# Altium schematic sheet SUPPLY.SchDoc
size A2
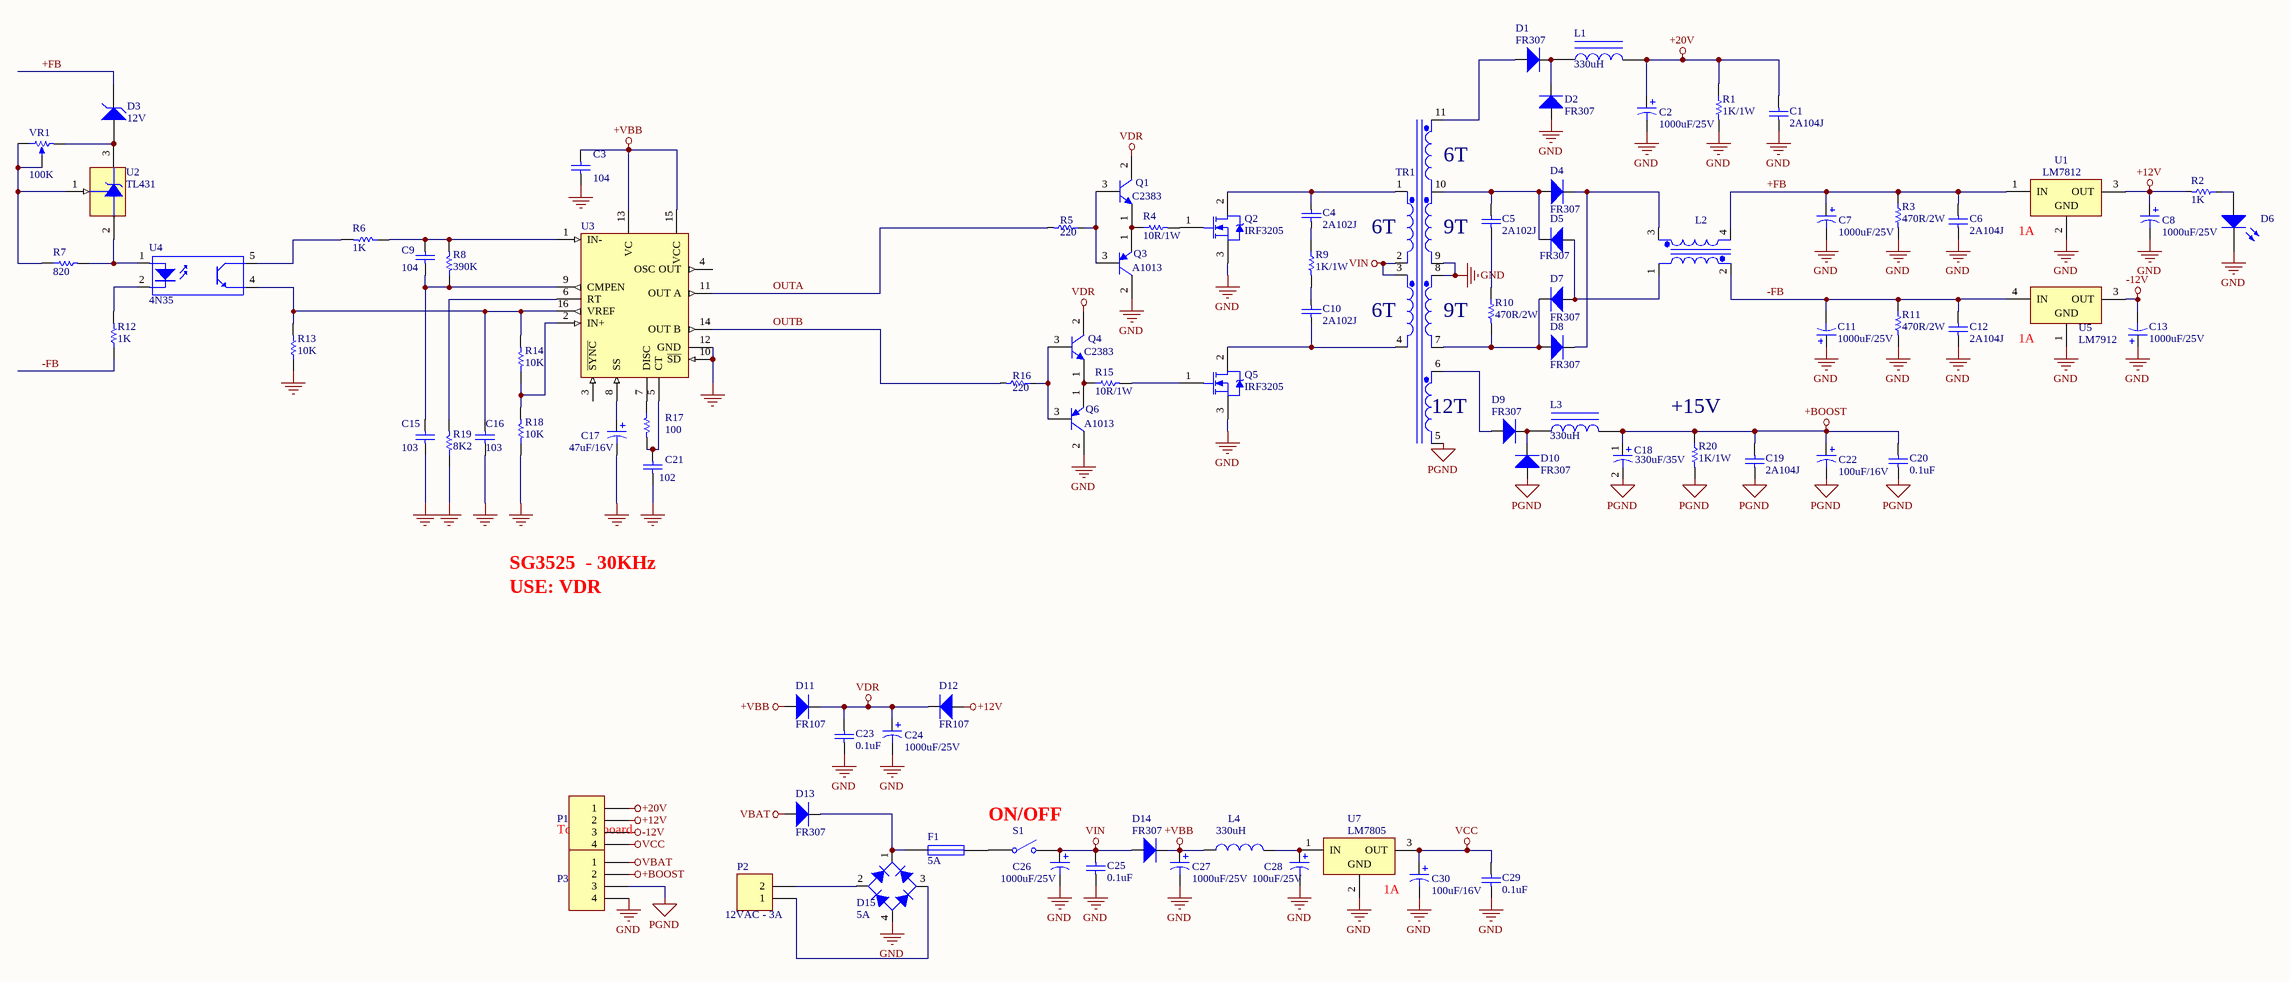
[diagram p0: SUPPLY.SchDoc]

## Parts
C1  2A104J  [CAP2/3]
C2  1000uF/25V  [C-400]
C3  104  [C1206]
C4  2A102J  [CAP200]
C5  2A102J  [CAP200]
C6  2A104J  [CAP2/3]
C7  1000uF/25V  [C-400]
C8  1000uF/25V  [C-400]
C9  104  [C1206]
C10  2A102J  [CAP200]
C11  1000uF/25V  [C-400]
C12  2A104J  [CAP2/3]
C13  1000uF/25V  [C-400]
C15  103  [C0805]
C16  103  [C0805]
C17  47uF/16V  [C107-SMD]
C18  330uF/35V  [CAP-100UF/63V]
C19  2A104J  [CAP2/3]
C20  0.1uF  [C1206]
C21  102  [C0805]
C22  100uF/16V  [CAP-100UF/16V]
C23  0.1uF  [C1206]
C24  1000uF/25V  [C-400]
C25  0.1uF  [C1206]
C26  1000uF/25V  [C-400]
C27  1000uF/25V  [C-400]
C28  value 100uF/25V  [CAP-100UF/16V]  (hidden comment: 100uF)
C29  0.1uF  [C1206]
C30  100uF/16V  [CAP-100UF/16V]
D1  FR307  [FR307]
D2  FR307  [FR307]
D3  12V  [1N4148]
D4  FR307  [FR307]
D5  FR307  [FR307]
D6  LED  [LED-1206/100x100]  (value not drawn)
D7  FR307  [FR307]
D8  FR307  [FR307]
D9  FR307  [FR307]
D10  FR307  [FR307]
D11  FR107  [DIODE-1A/150]
D12  FR107  [DIODE-1A/300]
D13  FR307  [FR307]
D14  FR307  [FR307]
D15  5A  [DB-5A]
F1  5A  [FUSE-AC]
L1  330uH  [L-330uH]
L2  Trans Cupl  [IDN-FILTER]  (value not drawn)
L3  330uH  [L-330uH]
L4  330uH  [L-330uH]
P1  Header 4  [H4-15A]  (value not drawn)
P2  Header 2  [H2-15A]  (value not drawn)
P3  Header 4  [H4-15A]  (value not drawn)
Q1  C2383  [TO-92]
Q2  IRF3205  [TO-220HSN]
Q3  A1013  [TO-92]
Q4  C2383  [TO-92]
Q5  IRF3205  [TO-220HSN]
Q6  A1013  [TO-92]
R1  1K/1W  [RES-500]
R2  1K  [R1206]
R3  470R/2W  [RES-2W/200]
R4  10R/1W  [RES-500]
R5  220  [R0805]
R6  1K  [R0805]
R7  820  [R0805]
R8  390K  [R0805]
R9  1K/1W  [RES-1W/110]
R10  470R/2W  [RES-2W/200]
R11  470R/2W  [RES-2W/200]
R12  1K  [R1206]
R13  10K  [R0805]
R14  10K  [R0805]
R15  10R/1W  [RES-500]
R16  220  [R0805]
R17  100  [R0805]
R18  10K  [R0805]
R19  8K2  [R0805]
R20  1K/1W  [RES-500]
S1  SW-SPST  [H2-15A]  (value not drawn)
TR1  TR3/5  [TRANS3/5]  (value not drawn)
U1  LM7812  [DDPAK/TO-263 (KTT)]
U2  TL431  [TO-92]
U3  SG3525AN  [648-06]  (value not drawn)
U4  4N35  [DIP-6/300]
U5  value LM7912  [DDPAK/TO-263 (KTT)]  (hidden comment: L7912CD2T)
U7  LM7805  [DDPAK/TO-263 (KTT)]
VR1  100K  [VR-S]

## Nets
+12V: C8.1 D12.1(A) P1.2 R2.2 U1.3(OUT)
+20V: C1.2 C2.1 L1.2 P1.1 R1.1
+BOOST: C18.1 C19.2 C20.1 C22.1 L3.2 P3.2 R20.1
+VBB: C3.2 C27.1 D11.1(A) D14.2(K) L4.1 U3.13(VC) U3.15(VCC)
-12V: C13.2 P1.3 U5.3(OUT)
GND: C1.1 C2.2 C3.1 C6.2 C7.2 C8.2 C11.1 C12.1 C13.1 C15.1 C16.1 C17.2 C21.1 C23.2 C24.2 C25.2 C26.2 C27.2 C28.2 C29.2 C30.2 D2.1(A) D6.2(K) D15.4(A) P3.4 Q2.3(S) Q3.2(C) Q5.3(S) Q6.2(C) R1.2 R3.2 R11.2 R13.1 R18.1 R19.1 TR1.8(Sec2+) TR1.9(Sec1-) U1.2(GND) U3.10(~{SD}) U3.12(GND) U5.1(GND) U7.2(GND)
PGND: C18.2 C19.1 C20.2 C22.2 D10.1(A) P3.3 R20.2 TR1.5(Sec3-)
VBAT: D13.1(A) P3.1
VCC: C29.1 C30.1 P1.4 U7.3(OUT)
VDR: C23.1 C24.1 D11.2(K) D12.2(K) Q1.2(C) Q4.2(C)
VIN: C25.1 C26.1 D14.1(A) S1.2(NO) TR1.2(Pri1-) TR1.3(Pri2+)
+FB: C6.1 C7.1 D3.2(K) L2.4(Sec-) R3.1 U1.1(IN)
-FB: C11.2 C12.2 L2.2(Pri-) R11.1 R12.1 U5.4(IN)
OUTA: R5.2 U3.11(OUT_A)
OUTB: R16.2 U3.14(OUT_B)
NetC4_1: C4.1 R9.1
NetC4_2: C4.2 Q2.2(D) TR1.1(Pri1+)
NetC5_1: C5.1 R10.1
NetC5_2: C5.2 D4.1(A) D5.2(K) TR1.10(Sec1+)
NetC9_1: C9.1 C15.2 R8.1 U3.9(CMPEN)
NetC9_2: C9.2 R6.1 R8.2 U3.1(IN-)
NetC10_1: C10.1 Q5.2(D) TR1.4(Pri2-)
NetC10_2: C10.2 R9.2
NetC16_2: C16.2 R13.2 R14.2 U3.16(VREF) U4.4(E)
NetC17_1: C17.1 U3.8(SS)
NetC21_2: C21.2 R17.2 U3.5(CT)
NetC28_1: C28.1 L4.2 U7.1(IN)
NetD1_1: D1.1(A) TR1.11(Sec4)
NetD1_2: D1.2(K) D2.2(K) L1.1
NetD3_1: D3.1(A) U2.3(K) VR1.2(BOT)
NetD4_2: D4.2(K) D8.2(K) L2.3(Sec+)
NetD5_1: D5.1(A) D7.1(A) L2.1(Pri+)
NetD6_1: D6.1(A) R2.1
NetD7_2: D7.2(K) D8.1(A) R10.2 TR1.7(Sec2-)
NetD9_1: D9.1(A) TR1.6(Sec3+)
NetD9_2: D9.2(K) D10.2(K) L3.1
NetD13_2: D13.2(K) D15.1(K) F1.2
NetD15_2: D15.2(C) P2.2
NetD15_3: D15.3(C) P2.1
NetF1_1: F1.1 S1.1(COMMON)
NetQ1_1: Q1.1(E) Q3.1(E) R4.1
NetQ1_3: Q1.3(B) Q3.3(B) R5.1
NetQ2_1: Q2.1(G) R4.2
NetQ4_1: Q4.1(E) Q6.1(E) R15.1
NetQ4_3: Q4.3(B) Q6.3(B) R16.1
NetQ5_1: Q5.1(G) R15.2
NetR6_2: R6.2 U4.5(C)
NetR7_1: R7.1 U2.1(REF) VR1.1(TOP) VR1.3(TAP)
NetR7_2: R7.2 U2.2(A) U4.1(A)
NetR12_2: R12.2 U4.2(K)
NetR14_1: R14.1 R18.2 U3.2(IN+)
NetR17_1: R17.1 U3.7(DISC)
NetR19_2: R19.2 U3.6(RT)

Not connected (* = marked no-connect by the designer): U3 3(~{SYNC}) 4(OSC_OUT)

## Notes on the sheet
- (near TR1) 6T
- (near TR1) 9T
- (near U1) 1A
- (near U5) 1A
- (near TR1) 12T
- (near R20) +15V
- SG3525  - 30KHz
- USE: VDR
- ON/OFF
- To Mainboard
- (near P2) 12VAC - 3A
- (near U7) 1A

## Library data of the parts
C1 C3-C6 C9 C10 C12 C15 C16 C19-C21 C23 C25 C29 = Cap: Capacitor; Published: 8-Jun-2000; LatestRevisionDate: 17-Jul-2002; LatestRevisionNote: Re-released for DXP Platform.; PackageReference: RAD-0.3; Publisher: Altium Limited
  C1 C6 C12 C19: Value: 2A104J
  C3 C9: Value: 104
  C4 C5 C10: Value: 2A102J
  C15 C16: Value: 103
  C20 C23 C25 C29: Value: 0.1uF
  C21: Value: 102
C2 C7 C8 C11 C13 C17 C24 C26-C28 = Cap Pol1: Polarized Capacitor (Radial); Published: 8-Jun-2000; LatestRevisionDate: 17-Jul-2002; LatestRevisionNote: Re-released for DXP Platform.; PackageReference: RB7.6-15; Publisher: Altium Limited
  C2 C7 C8 C11 C13 C24 C26 C27: Value: 1000uF/25V
  C17: Value: 47uF/16V
C18 = Cap Pol1: Polarized Capacitor (Radial); Value: 330uF/35V SMD; Published: 8-Jun-2000; LatestRevisionDate: 17-Jul-2002; LatestRevisionNote: Re-released for DXP Platform.; PackageReference: RB7.6-15; Publisher: Altium Limited
C22 C30 = Cap Pol1: Polarized Capacitor (Radial); Value: 100uF/16V SMD; Published: 8-Jun-2000; LatestRevisionDate: 17-Jul-2002; LatestRevisionNote: Re-released for DXP Platform.; PackageReference: RB7.6-15; Publisher: Altium Limited
D1 D2 D4 D5 D7-D14 = Diode 1N4148: High Conductance Fast Diode; Published: 8-Jun-2000; LatestRevisionDate: 17-Jul-2002; LatestRevisionNote: Re-released for DXP Platform.; DatasheetDocument: 1997; PackageReference: DO-35; Publisher: Altium Limited; Code_JEDEC: DO-204-AH; ComponentLink1Description: Manufacturer Link; ComponentLink1URL: http://www.fairchildsemi.com/; ComponentLink2Description: Datasheet; ComponentLink2URL: http://www.fairchildsemi.com/ds/1N%2F1N4148.pdf
  D1 D2 D4 D5 D7-D10 D13 D14: Value: FR307
  D11 D12: Value: FR107
D3 = D Zener: Zener Diode; Published: 8-Jun-2000; LatestRevisionDate: 17-Jul-2002; LatestRevisionNote: Re-released for DXP Platform.; PackageReference: DIODE-0.7; Publisher: Altium Limited; Value: 12V
D6 = LED0: Typical INFRARED GaAs LED; Published: 8-Jun-2000; LatestRevisionDate: 08-Jul-2005; LatestRevisionNote: Mech Layer 1 removed.; PackageReference: LED-0; Publisher: Altium Limited; Value: LED
D15 = Bridge1: Full Wave Diode Bridge; Value: BRIGDE-5A; Published: 8-Jun-2000; LatestRevisionDate: 17-Jul-2002; LatestRevisionNote: Re-released for DXP Platform.; PackageReference: D-38; Publisher: Altium Limited
F1 = Fuse 1: Fuse; Published: 8-Jun-2000; LatestRevisionDate: 17-Jul-2002; LatestRevisionNote: Re-released for DXP Platform.; PackageReference: PIN-W2/E2.8; Publisher: Altium Limited; Value: 5A
L1 L3 = Inductor Iron: Magnetic-Core Inductor; Manufacturer: Generic Components; Class: Passive; Published: 1999; SubClass: Inductor; Value: 330uH
L2 = Trans Cupl: Transformer (Coupled Inductor Model); Published: 8-Jun-2000; LatestRevisionDate: 17-Jul-2002; LatestRevisionNote: Re-released for DXP Platform.; PackageReference: TRF_4; Publisher: Altium Limited
L4 = Inductor: Code_IEC: 1005; Published: 8-Jun-2000; LatestRevisionDate: 17-Jul-2002; LatestRevisionNote: Re-released for DXP Platform.; PackageReference: 0402-A; Publisher: Altium Limited; Code_JEITA: 0402; Value: 330uH
P1 P3 = Header 4: Header, 4-Pin; LatestRevisionDate: 17-Jul-2002; LatestRevisionNote: Re-released for DXP Platform.; Publisher: Altium Limited
P2 = Header 2: Header, 2-Pin; LatestRevisionDate: 17-Jul-2002; LatestRevisionNote: Re-released for DXP Platform.; Publisher: Altium Limited; Value: Header 2
Q1 Q4 = 2N3904: NPN General Purpose Amplifier; Published: 8-Jun-2000; LatestRevisionDate: 15-Jan-2003; LatestRevisionNote: PCB Footprint 'BCY-W3/D4.7' replaced; DatasheetDocument: 1997; PackageDocument: Sep-1998; PackageReference: TO-92A; Publisher: Altium Limited; Code_JEDEC: TO-92A; ComponentLink1Description: Manufacturer Link; ComponentLink1URL: http://www.fairchildsemi.com/; ComponentLink2Description: Datasheet; ComponentLink2URL: http://www.fairchildsemi.com/ds/2N%2F2N3904.pdf; value: C2383
Q2 Q5 = IRF3205: HEXFET Power MOSFET; Note: Pin 2 is electrically connected to pin 4.; Published: 8-Jun-2000; LatestRevisionDate: 17-Jul-2002; LatestRevisionNote: Re-released for DXP Platform.; DatasheetVersion: Aug-1997; PackageVersion: Feb-1997; PackageReference: TO-220AB; Publisher: Altium Limited; PackageDescription: TO, Thru-Hole, Vertical, Heatsink Mounted; 3 In-Line Leads; Pitch 2.54 mm; ComponentLink1Description: Manufacturer Link; ComponentLink1URL: http://www.irf.com/; ComponentLink2Description: Datasheet; ComponentLink2URL: http://www.irf.com/product-info/datasheets/data/irf3205.pdf; Value: IRF3205
Q3 Q6 = 2N3906: PNP General Purpose Amplifier; Manufacturer: Generic Components; Revised: 11-July-2000: SIM Model Added.; Class: Discrete; SubClass: BJT - Low Power; Published: 08/06/2000; Publisher: Altium Hobart Technology Centre; Value: A1013
R1-R20 = Res1: Resistor; Published: 8-Jun-2000; LatestRevisionDate: 17-Jul-2002; LatestRevisionNote: Re-released for DXP Platform.; PackageReference: AXIAL-0.3; Publisher: Altium Limited
  R1 R9 R20: Value: 1K/1W
  R2 R6 R12: Value: 1K
  R3 R10 R11: Value: 470R/2W
  R4 R15: Value: 10R/1W
  R5 R16: Value: 220
  R7: Value: 820
  R8: Value: 390K
  R13 R14 R18: Value: 10K
  R17: Value: 100
  R19: Value: 8K2
S1 = SW-SPST: Single-Pole, Single-Throw Switch; Value: SW2; Published: 24-Mar-1999; LatestRevisionDate: 17-Jul-2002; LatestRevisionNote: Re-released for DXP Platform.; PackageReference: SPST-2; Publisher: Altium Limited
TR1 = TRANS3/5: Transformer power supply for accu recovery; Value: TR3/5
U1 U7 = MC7805CT: 3-Terminal Positive Fixed Voltage Regulator; Note: Pin 2 is electrically connected to TAB; Published: 17-Jul-2002; DatasheetVersion: 1988; PackageReference: 221A-04; Publisher: Altium Limited; PackageDescription: TO, Thru-Hole, Vertical, Heatsink Mounted; 3 In-Line Leads; Pitch 2.54 mm; Code_JEDEC: TO-262-AA; ComponentLink1Description: Manufacturer Link; ComponentLink1URL: http://www.onsemi.com/site/products/taxonomy/0,4438,503,00.html; ComponentLink2Description: Datasheet; ComponentLink2URL: http://www.onsemi.com/pub/Collateral/MC7800-D.PDF
  U1: Value: LM7812
  U7: value: LM7805
U2 = TL431ACLP: Programmable Precision Reference; Published: 17-Jul-2002; DatasheetVersion: 1988; PackageVersion: 1996; PackageReference: 29-04; Publisher: Altium Limited; PackageDescription: TO, Flat Index; 3 In-Line, Axial Leads; Body Dia. 4.8mm; Leads 0.48 x 0.5 mm (max); ComponentLink1Description: Manufacturer Link; ComponentLink1URL: http://www.onsemi.com/site/products/taxonomy/0,4438,503,00.html; ComponentLink2Description: Datasheet; ComponentLink2URL: http://www.onsemi.com/pub/Collateral/TL431-D.PDF; Value: TL431
U3 = SG3525AN: Pulse Width Modulator Control Circuit; Published: 17-Jul-2002; LatestRevisionDate: 06-Jun-2005; LatestRevisionNote: Stylized 3D Model Added.; DatasheetVersion: 1988; PackageReference: 648-06; Publisher: Altium Limited; PackageDescription: DIP; 16 Leads; Row Spacing 7.62 mm; Pitch 2.54 mm; ComponentLink1Description: Manufacturer Link; ComponentLink1URL: http://www.onsemi.com/site/products/taxonomy/0,4438,503,00.html
U5 = L7912CD2T: IC REG NEG VOLT 12V D2PAK; Part Number: L7912CD2T-TR; Manufacturer: STMicroelectronics; Link: http://search.digikey.com/scripts/DkSearch/dksus.dll?Detail&name=497-1215-1-ND
VR1 = RPot: Potentiometer; Sim Note: Enter the Resistance value and the set point into parameter fields.; Set Position: 0.5; Published: 8-Jun-2000; LatestRevisionDate: 17-Jul-2002; LatestRevisionNote: Re-released for DXP Platform.; PackageReference: VR5; Publisher: Altium Limited; Value: 100K
U4 = 4N35: Value: 4N35